# Altium project main_io.PrjPcb (part 3 of 6)

## Sheet can_uart.SchDoc: CAN and UART Interfaces
size A4; Organization: Badgerloop Electrical; Address1: 133 Engineering Research Building; Address2: 1500 Engineering Drive; Address3: Madison, Wi 53706
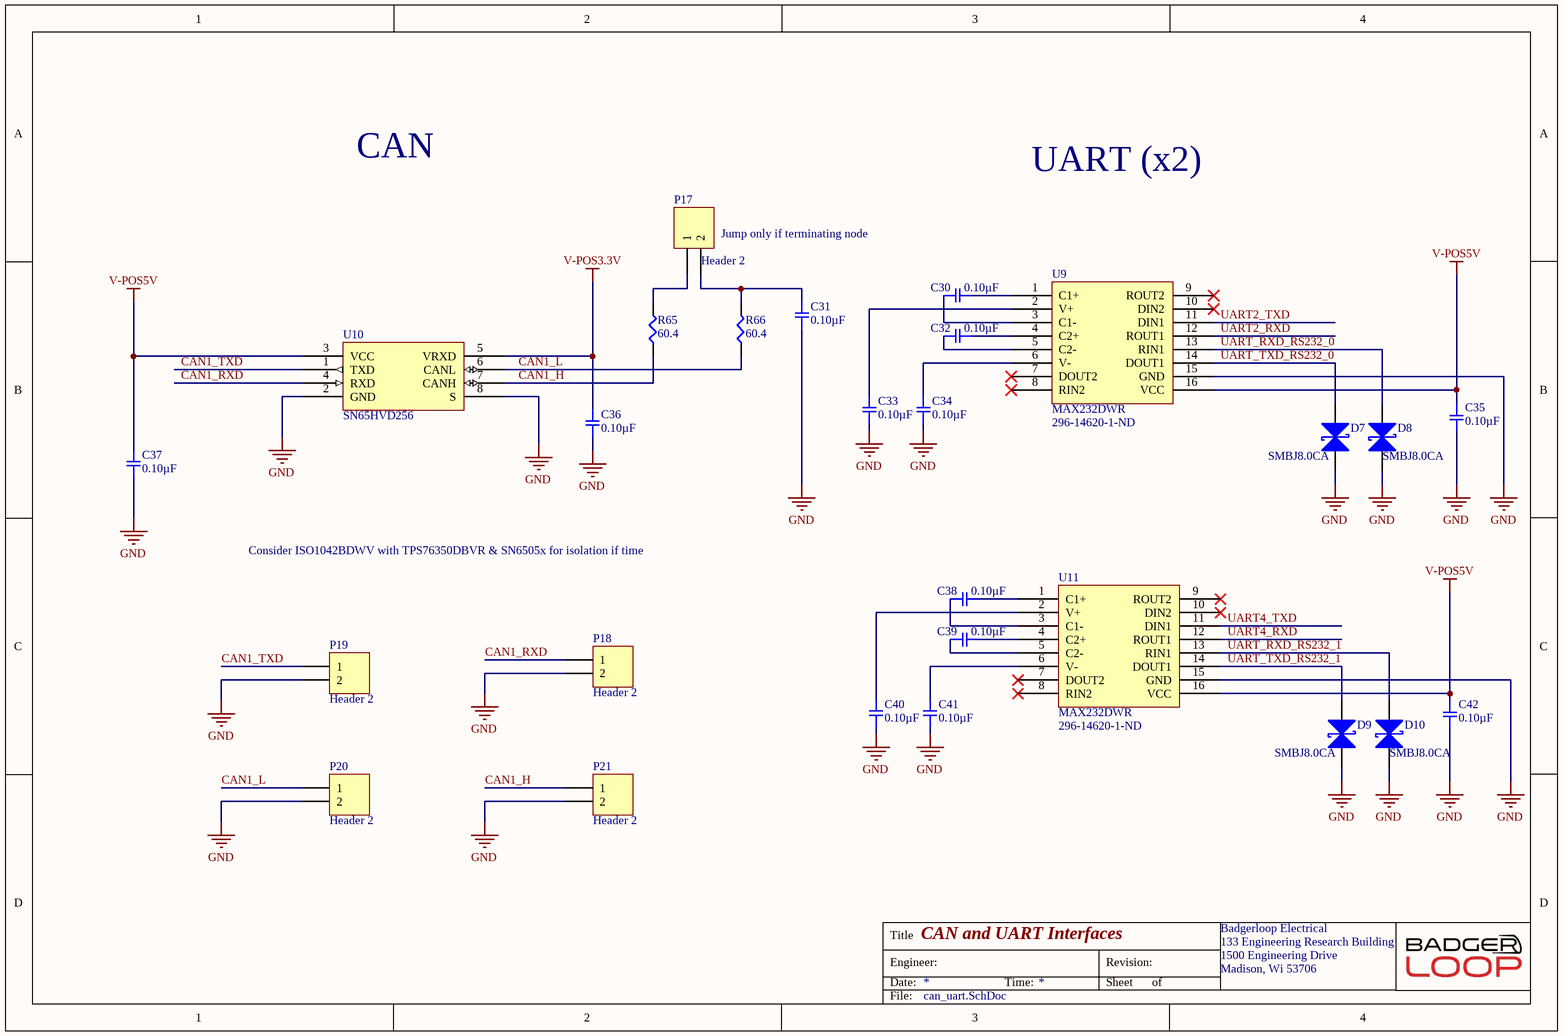
[diagram p6: can_uart.SchDoc]

### Parts
C30  0.10µF  [SMD-0805C]
C31  0.10µF  [SMD-0805C]
C32  0.10µF  [SMD-0805C]
C33  0.10µF  [SMD-0805C]
C34  0.10µF  [SMD-0805C]
C35  0.10µF  [SMD-0805C]
C36  0.10µF  [SMD-0805C]
C37  0.10µF  [SMD-0805C]
C38  0.10µF  [SMD-0805C]
C39  0.10µF  [SMD-0805C]
C40  0.10µF  [SMD-0805C]
C41  0.10µF  [SMD-0805C]
C42  0.10µF  [SMD-0805C]
D7  SMBJ8.0CA  [DIOM4436X26N]
D8  SMBJ8.0CA  [DIOM4436X26N]
D9  SMBJ8.0CA  [DIOM4436X26N]
D10  SMBJ8.0CA  [DIOM4436X26N]
P17  Header 2  [Pin Header 1x2 TH Pitch 2.54mm]
P18  Header 2  [Pin Header 1x2 TH Pitch 2.54mm]
P19  Header 2  [Pin Header 1x2 TH Pitch 2.54mm]
P20  Header 2  [Pin Header 1x2 TH Pitch 2.54mm]
P21  Header 2  [Pin Header 1x2 TH Pitch 2.54mm]
R65  60.4  [SMD-1206-RES]
R66  60.4  [SMD-1206-RES]
U9  MAX232DWR  Supplier Part Number 1: 296-14620-1-ND  [SOP127P1060X175-16N]
U10  SN65HVD256  [SOIC127P610X280-8N]
U11  MAX232DWR  Supplier Part Number 1: 296-14620-1-ND  [SOP127P1060X175-16N]

### Nets
GND: C31.1 C33.1 C34.1 C35.2 C36.1 C37.1 C40.1 C41.1 C42.2 D7.1(A) D8.1(A) D9.1(A) D10.1(A) P18.2 P19.2 P20.2 P21.2 U9.15(GND) U10.2(GND) U10.8(S) U11.15(GND)
V-POS3.3V: C36.2 U10.5(VRXD)
V-POS5V: C35.1 C37.2 C42.1 U9.16(VCC) U10.3(VCC) U11.16(VCC)
CAN1_H: P21.1 R65.1 U10.7(CANH)
CAN1_L: P20.1 R66.1 U10.6(CANL)
CAN1_RXD: P18.1 U10.4(RXD)
CAN1_TXD: P19.1 U10.1(TXD)
UART2_RXD: U9.12(ROUT1)
UART2_TXD: U9.11(DIN1)
UART4_RXD: U11.12(ROUT1)
UART4_TXD: U11.11(DIN1)
UART_RXD_RS232_0: D8.2(K) U9.13(RIN1)
UART_RXD_RS232_1: D10.2(K) U11.13(RIN1)
UART_TXD_RS232_0: D7.2(K) U9.14(DOUT1)
UART_TXD_RS232_1: D9.2(K) U11.14(DOUT1)
NetC30_1: C30.1 U9.3(C1-)
NetC30_2: C30.2 U9.1(C1+)
NetC31_2: C31.2 P17.2 R66.2
NetC32_1: C32.1 U9.5(C2-)
NetC32_2: C32.2 U9.4(C2+)
NetC33_2: C33.2 U9.2(V+)
NetC34_2: C34.2 U9.6(V-)
NetC38_1: C38.1 U11.3(C1-)
NetC38_2: C38.2 U11.1(C1+)
NetC39_1: C39.1 U11.5(C2-)
NetC39_2: C39.2 U11.4(C2+)
NetC40_2: C40.2 U11.2(V+)
NetC41_2: C41.2 U11.6(V-)
NetP17_1: P17.1 R65.2

Not connected (* = marked no-connect by the designer): U9 7(DOUT2)* 8(RIN2)* 9(ROUT2)* 10(DIN2)*; U11 7(DOUT2)* 8(RIN2)* 9(ROUT2)* 10(DIN2)*

### Notes on the sheet
- CAN
- UART (x2)
- (near P17) Jump only if terminating node
- Consider ISO1042BDWV with TPS76350DBVR & SN6505x for isolation if time
- Title
- Engineer:
- Date:
- Time:
- Revision:
- Sheet
- of
- File:

### Library data of the parts
C30-C34 C36-C41 = GRM219R71C104JA01D: CAP CER 0.1UF 16V X7R 0805; Manufacturer: Murata Electronics North America; Factory Stock: 0; Unit Price (USD): 0.12; Minimum Quantity: 1; Tolerance: ±5%; Datasheets: -; Image: //media.digikey.com/Renders/Murata%20Renders/0805%20(2012%20Metric)%20.85mm.jpg; Digi-Key Part Number: 490-12557-1-ND; Part Number: GRM219R71C104JA01D; Quantity Available: 6635; @ qty: 0; Packaging: Cut Tape (CT); Series: GRM; Part Status: Active; Value: 0.10µF; Voltage: 16V; Temperature Coefficient: X7R; Operating Temperature: -55°C ~ 125°C; Features: -; Ratings: -; Applications: General Purpose; Mounting Type: Surface Mount, MLCC; Package / Case: 0805 (2012 Metric); Size / Dimension: 0.079" L x 0.049" W (2.00mm x 1.25mm); Height - Seated (Max): -; Thickness (Max): 0.037" (0.95mm); Lead Spacing: -; Lead Style: -
C35 C42 = GRM219R71E104KA01D: CAP CER 0.1UF 25V X7R 0805; Manufacturer: Murata Electronics North America; Factory Stock: 0; Unit Price (USD): 0.12; Minimum Quantity: 1; Tolerance: ±10%; Datasheets: http://www.murata.com/~/media/webrenewal/support/library/catalog/products/capacitor/mlcc/c02e.pdf; Image: //media.digikey.com/Renders/Murata%20Renders/0805%20(2012%20Metric)%20.85mm.jpg; Digi-Key Part Number: 490-12754-1-ND; Part Number: GRM219R71E104KA01D; Quantity Available: 8594; @ qty: 0; Packaging: Cut Tape (CT); Series: GRM; Part Status: Active; Value: 0.10µF; Voltage: 25V; Temperature Coefficient: X7R; Operating Temperature: -55°C ~ 125°C; Features: -; Ratings: -; Applications: General Purpose; Mounting Type: Surface Mount, MLCC; Package / Case: 0805 (2012 Metric); Size / Dimension: 0.079" L x 0.049" W (2.00mm x 1.25mm); Height - Seated (Max): -; Thickness (Max): 0.037" (0.95mm); Lead Spacing: -; Lead Style: -
D7-D10 = SMBJ8.0CA: TVS DIODE 8V 13.6V DO214AA; Manufacturer: Littelfuse; Polarity: Bidirectional; Peak Pulse Power: 600W; Max Surge Current: 44.2A; Breakdown Voltage: 8.89V; Test Current: 1mA; Number of Channels: 1; Leakage Current: 100uA; Power Line Protection: No; Max Breakdown Voltage: 9.83V; Supplier 1: Digi-Key; Stock 1: 700; Pricing 1: 1=0.39, 10=0.313, 25=0.2864, 100=0.1798, 250=0.17784, 500=0.1665, 1000=0.11322 (USD); Mount: Surface Mount; Case/Package: SMB; Number of Pins: 2; Min Operating Temperature: -65°C; Max Operating Temperature: 150°C; Packaging: Tape and Reel; Clamping Voltage: 13.6V; Package Quantity: 3000; Reverse Standoff Voltage: 8V; Min Breakdown Voltage: 8.89V; Peak Pulse Current: 44.2A; Direction: Bidirectional; Reverse Breakdown Voltage: 8.89V; Operating Supply Voltage: 8V; Termination: SMD/SMT; Number of Elements: 1; Number of Bidirectional Channels: 1; Composition: Zener; Max Power Dissipation: 600W; Voltage Rating (DC): 8V; Power Dissipation: 600W; Length: 5.59mm; Height: 2.44mm; Width: 3.94mm; Lead Free: Lead Free; REACH SVHC: No SVHC; ComponentLink1URL: http://www.littelfuse.com/~/media/electronics/datasheets/tvs_diodes/littelfuse_tvs_diode_smbj_datasheet.pdf.pdf?src-supplier=Digi-Key; ComponentLink1Description: http://www.littelfuse.com/~/media/electronics/datasheets/tvs_diodes/littelfuse_tvs_diode_smbj_datasheet.pdf.pdf?src-supplier=Digi-Key; ComponentLink2URL: http://www.littelfuse.com/data/en/Data_Sheets/Littelfuse_TVS-Diode_SMBJ.pdf?src-supplier=Element14; ComponentLink2Description: http://www.littelfuse.com/data/en/Data_Sheets/Littelfuse_TVS-Diode_SMBJ.pdf?src-supplier=Element14; Supplier Part Number 1: SMBJ8.0CALFCT-ND
P17-P21 = Header 2: Header, 2-Pin; LatestRevisionDate: 17-Jul-2002; LatestRevisionNote: Re-released for DXP Platform.; Publisher: Altium Limited
R65 R66 = ERJ-8ENF60R4V: RES SMD 60.4 OHM 1% 1/4W 1206; Manufacturer: Panasonic Electronic Components; Factory Stock: 0; Unit Price (USD): 0.00933; @ qty: 1500; Minimum Quantity: 1; Power (Watts): 0.25W, 1/4W; Temperature Coefficient: ±100ppm/°C; Part Number: ERJ-8ENF60R4V; Datasheets: http://industrial.panasonic.com/www-cgi/jvcr13pz.cgi?E+PZ+3+AOA0002+ERJ8ENF60R4V+7+WW; Image: //media.digikey.com/Renders/Panasonic%20Renders/ERJ-1206%20Pkg.jpg; Digi-Key Part Number: P60.4FCT-ND; Quantity Available: 94102; Packaging: Cut Tape (CT); Series: ERJ; Part Status: Active; Value: 60.4; Tolerance: ±1%; Composition: Thick Film; Features: Automotive AEC-Q200; Operating Temperature: -55°C ~ 155°C; Package / Case: 1206 (3216 Metric); Supplier Device Package: 1206; Size / Dimension: 0.126" L x 0.063" W (3.20mm x 1.60mm); Height - Seated (Max): 0.028" (0.70mm); Number of Terminations: 2; Failure Rate: -
U9 U11 = MAX232DWR: IC DRVR/RCVR MULTCH RS232 16SOIC; Manufacturer: Texas Instruments; Nominal Supply Current: 10mA; Data Rate: 120Kbps; Number of Drivers: 2; Operating Supply Voltage: 5V; Min Supply Voltage: 4.5V; Max Supply Voltage: 5.5V; Logic Function: Transceiver,Receiver; Number of Transceivers: 1; Simplex/Duplex: Full Duplex; Supplier 1: Digi-Key; Manufacturer Part Number: MAX232DWR; Stock 1: 5901; Pricing 1: 1=1.16, 10=1.036, 100=0.7551, 500=0.63222, 1000=0.49172 (USD); Mount: Surface Mount; Case/Package: SOIC; Number of Pins: 16; Weight: 0.014829oz; Min Operating Temperature: -40°C; Max Operating Temperature: 85°C; Packaging: Tape and Reel; Package Quantity: 2000; Number of Receivers: 2; Number of Transmitters: 2; Length: 10.28mm; Height: 2.35mm; Width: 7.52mm; Radiation Hardening: No; Lead Free: Lead Free; REACH SVHC: No SVHC; ComponentLink1URL: http://www.ti.com/lit/ds/symlink/max232.pdf?src-supplier=Digi-Key; ComponentLink1Description: http://www.ti.com/lit/ds/symlink/max232.pdf?src-supplier=Digi-Key; ComponentLink2URL: http://datasheet.iiic.cc/texas_instruments/MAX232DWR.pdf?src-supplier=IIIC; ComponentLink2Description: http://datasheet.iiic.cc/texas_instruments/MAX232DWR.pdf?src-supplier=IIIC
U10 = SN65HVD256: IC TXRX CAN 5V HS 8SOIC; Manufacturer: TI; Manufacturer P/N: SN65HVD256DR; Digikey P/N: 296-30093-1-ND; Digikey Link: https://www.digikey.com/product-detail/en/texas-instruments/SN65HVD256DR/296-30093-1-ND/2798832

## Sheet retros.SchDoc: Retros
size A4; Organization: Badgerloop Electrical; Address1: 133 Engineering Research Building; Address2: 1500 Engineering Drive; Address3: Madison, Wi 53706
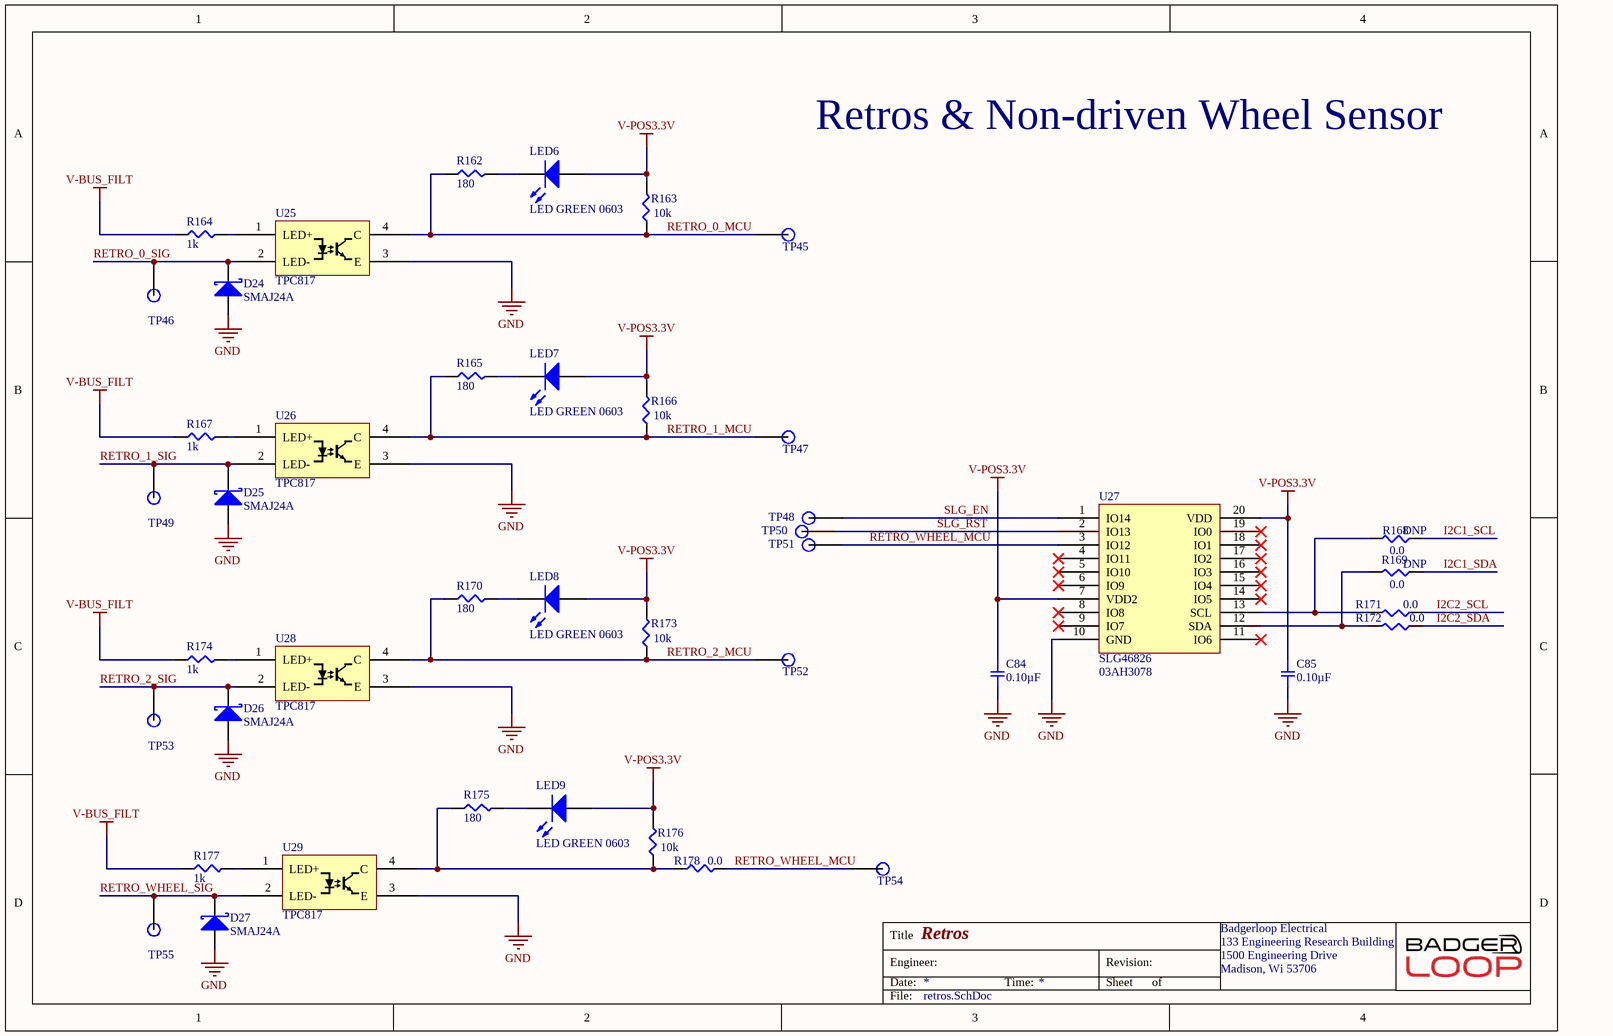
[diagram p7: retros.SchDoc]

### Parts
C84  0.10µF  [SMD-0805C]
C85  0.10µF  [SMD-0805C]
D24  SMAJ24A  [INDM5026X18N]
D25  SMAJ24A  [INDM5026X18N]
D26  SMAJ24A  [INDM5026X18N]
D27  SMAJ24A  [INDM5026X18N]
LED6  LED GREEN 0603  [LED 0603 GREEN]
LED7  LED GREEN 0603  [LED 0603 GREEN]
LED8  LED GREEN 0603  [LED 0603 GREEN]
LED9  LED GREEN 0603  [LED 0603 GREEN]
R162  180  [SMD-0805-RES]
R163  10k  [SMD-0805-RES]
R164  1k  [SMD-0805-RES]
R165  180  [SMD-0805-RES]
R166  10k  [SMD-0805-RES]
R167  1k  [SMD-0805-RES]
R168  0.0  [SMD-0805-RES]
R169  0.0  [SMD-0805-RES]
R170  180  [SMD-0805-RES]
R171  0.0  [SMD-0805-RES]
R172  0.0  [SMD-0805-RES]
R173  10k  [SMD-0805-RES]
R174  1k  [SMD-0805-RES]
R175  180  [SMD-0805-RES]
R176  10k  [SMD-0805-RES]
R177  1k  [SMD-0805-RES]
R178  0.0  [SMD-1206-RES]
TP45  TP  [Test Point]  (value not drawn)
TP46  TP  [Test Point]  (value not drawn)
TP47  TP  [Test Point]  (value not drawn)
TP48  TP  [Test Point]  (value not drawn)
TP49  TP  [Test Point]  (value not drawn)
TP50  TP  [Test Point]  (value not drawn)
TP51  TP  [Test Point]  (value not drawn)
TP52  TP  [Test Point]  (value not drawn)
TP53  TP  [Test Point]  (value not drawn)
TP54  TP  [Test Point]  (value not drawn)
TP55  TP  [Test Point]  (value not drawn)
U25  TPC817  [SOT200P1005X328-5N]
U26  TPC817  [SOT200P1005X328-5N]
U27  SLG46826  Supplier Part Number 1: 03AH3078  [SOP65P640X175-20N]
U28  TPC817  [SOT200P1005X328-5N]
U29  TPC817  [SOT200P1005X328-5N]

### Nets
GND: C84.2 C85.2 D24.2(K) D25.2(K) D26.2(K) D27.2(K) U25.3(E) U26.3(E) U27.10(GND) U28.3(E) U29.3(E)
V-BUS_FILT: R164.1 R167.1 R174.1 R177.1  [project net MSTR_SW +]
V-POS3.3V: C84.1 C85.1 LED6.1(A) LED7.1(A) LED8.1(A) LED9.1(A) R163.2 R166.2 R173.2 R176.2 U27.7(VDD2) U27.20(VDD)
I2C1_SCL: R168.1
I2C1_SDA: R169.1
I2C2_SCL: R171.1
I2C2_SDA: R172.1
RETRO_0_MCU: R162.1 R163.1 TP45.1 U25.4(C)
RETRO_0_SIG: D24.1(A) TP46.1 U25.2(LED-)
RETRO_1_MCU: R165.1 R166.1 TP47.1 U26.4(C)
RETRO_1_SIG: D25.1(A) TP49.1 U26.2(LED-)
RETRO_2_MCU: R170.1 R173.1 TP52.1 U28.4(C)
RETRO_2_SIG: D26.1(A) TP53.1 U28.2(LED-)
RETRO_WHEEL_MCU: R178.2 TP51.1 TP54.1 U27.3(IO12)
RETRO_WHEEL_SIG: D27.1(A) TP55.1 U29.2(LED-)
SLG_EN: TP48.1 U27.1(IO14)
SLG_RST: TP50.1 U27.2(IO13)
NetLED6_2: LED6.2(K) R162.2
NetLED7_2: LED7.2(K) R165.2
NetLED8_2: LED8.2(K) R170.2
NetLED9_2: LED9.2(K) R175.2
NetR164_2: R164.2 U25.1(LED+)
NetR167_2: R167.2 U26.1(LED+)
NetR168_2: R168.2 R171.2 U27.13(SCL)
NetR169_2: R169.2 R172.2 U27.12(SDA)
NetR174_2: R174.2 U28.1(LED+)
NetR175_1: R175.1 R176.1 R178.1 U29.4(C)
NetR177_2: R177.2 U29.1(LED+)

Not connected (* = marked no-connect by the designer): U27 4(IO11)* 5(IO10)* 6(IO9)* 8(IO8)* 9(IO7)* 11(IO6)* 14(IO5)* 15(IO4)* 16(IO3)* 17(IO2)* 18(IO1)* 19(IO0)*

### Notes on the sheet
- Retros & Non-driven Wheel Sensor
- Title
- Engineer:
- Date:
- Time:
- Revision:
- Sheet
- of
- File:

### Library data of the parts
C84 C85 = GRM219R71E104KA01D: as C35 on sheet can_uart; Datasheets: http://www.murata.com/~/media/webrenewal/support/library/catalog/products/capacitor/mlcc/c02e.pdf; Image: //media.digikey.com/Renders/Murata%20Renders/0805%20(2012%20Metric)%20.85mm.jpg; Digi-Key Part Number: 490-12754-1-ND; Part Number: GRM219R71E104KA01D; Quantity Available: 8594; @ qty: 0; Packaging: Cut Tape (CT); Series: GRM; Part Status: Active; Value: 0.10µF; Voltage: 25V; Temperature Coefficient: X7R; Operating Temperature: -55°C ~ 125°C; Features: -; Ratings: -; Applications: General Purpose; Mounting Type: Surface Mount, MLCC; Package / Case: 0805 (2012 Metric); Size / Dimension: 0.079" L x 0.049" W (2.00mm x 1.25mm); Height - Seated (Max): -; Thickness (Max): 0.037" (0.95mm); Lead Spacing: -; Lead Style: -
D24-D27 = SMAJ24A: TVS DIODE 24V 38.9V DO214AC; Manufacturer: LittelFuse Inc; Digikey P/N: SMAJ24ALFCT-ND; Digikey Link: https://www.digikey.com/product-detail/en/littelfuse-inc/SMAJ24A/SMAJ24ALFCT-ND/762500; Manufacturer P/N: SMAJ24A
LED6-LED9 = LED GREEN 0603: Manufacturer: Lite-On Inc.; Manufacturer P/N: LTST-C190KGKT; Digikey P/N: 160-1435-1-ND; Package / Case: 0603; Color: GREEN
R162 R165 R170 R175 = ERJ-6ENF1800V: RES SMD 180 OHM 1% 1/8W 0805; Manufacturer: Panasonic Electronic Components; Factory Stock: 0; Unit Price (USD): 0.00729; @ qty: 1500; Minimum Quantity: 1; Power (Watts): 0.125W, 1/8W; Temperature Coefficient: ±100ppm/°C; Part Number: ERJ-6ENF1800V; Datasheets: http://industrial.panasonic.com/www-cgi/jvcr13pz.cgi?E+PZ+3+AOA0002+ERJ6ENF1800V+7+WW; Image: //media.digikey.com/Renders/Panasonic%20Renders/ERJ-0805%20Pkg.jpg; Digi-Key Part Number: P180CCT-ND; Quantity Available: 33231; Packaging: Cut Tape (CT); Series: ERJ; Part Status: Active; Value: 180; Tolerance: ±1%; Composition: Thick Film; Features: Automotive AEC-Q200; Operating Temperature: -55°C ~ 155°C; Package / Case: 0805 (2012 Metric); Supplier Device Package: 0805; Size / Dimension: 0.079" L x 0.049" W (2.00mm x 1.25mm); Height - Seated (Max): 0.028" (0.70mm); Number of Terminations: 2; Failure Rate: -
R163 R166 R173 R176 = ERJ-6GEYJ103V: RES SMD 10K OHM 5% 1/8W 0805; Manufacturer: Panasonic Electronic Components; Factory Stock: 0; Unit Price (USD): 0.00496; @ qty: 1500; Minimum Quantity: 1; Power (Watts): 0.125W, 1/8W; Temperature Coefficient: ±200ppm/°C; Part Number: ERJ-6GEYJ103V; Datasheets: http://industrial.panasonic.com/www-cgi/jvcr13pz.cgi?E+PZ+3+AOA0001+ERJ6GEYJ103V+7+WW; Image: //media.digikey.com/Renders/Panasonic%20Renders/ERJ-0805%20Pkg.jpg; Digi-Key Part Number: P10KACT-ND; Quantity Available: 2328224; Packaging: Cut Tape (CT); Series: ERJ; Part Status: Active; Value: 10k; Tolerance: ±5%; Composition: Thick Film; Features: Automotive AEC-Q200; Operating Temperature: -55°C ~ 155°C; Package / Case: 0805 (2012 Metric); Supplier Device Package: 0805; Size / Dimension: 0.079" L x 0.049" W (2.00mm x 1.25mm); Height - Seated (Max): 0.028" (0.70mm); Number of Terminations: 2; Failure Rate: -
R164 R167 R174 R177 = ERJ-6ENF1001V: RES SMD 1K OHM 1% 1/8W 0805; Manufacturer: Panasonic Electronic Components; Factory Stock: 0; Unit Price (USD): 0.00729; @ qty: 1500; Minimum Quantity: 1; Power (Watts): 0.125W, 1/8W; Temperature Coefficient: ±100ppm/°C; Part Number: ERJ-6ENF1001V; Datasheets: http://industrial.panasonic.com/www-cgi/jvcr13pz.cgi?E+PZ+3+AOA0002+ERJ6ENF1001V+7+WW; Image: //media.digikey.com/Renders/Panasonic%20Renders/ERJ-0805%20Pkg.jpg; Digi-Key Part Number: P1.00KCCT-ND; Quantity Available: 12895103; Packaging: Cut Tape (CT); Series: ERJ; Part Status: Active; Value: 1k; Tolerance: ±1%; Composition: Thick Film; Features: Automotive AEC-Q200; Operating Temperature: -55°C ~ 155°C; Package / Case: 0805 (2012 Metric); Supplier Device Package: 0805; Size / Dimension: 0.079" L x 0.049" W (2.00mm x 1.25mm); Height - Seated (Max): 0.028" (0.70mm); Number of Terminations: 2; Failure Rate: -
R168 R169 R171 R172 = ERJ-6GEY0R00V: RES SMD 0.0 OHM JUMPER 1/8W 0805; Manufacturer: Panasonic Electronic Components; Factory Stock: 0; Unit Price (USD): 0.00544; @ qty: 1500; Minimum Quantity: 1; Power (Watts): 0.125W, 1/8W; Part Number: ERJ-6GEY0R00V; Datasheets: http://industrial.panasonic.com/www-cgi/jvcr13pz.cgi?E+PZ+3+AOA0001+ERJ6GEY0R00V+7+WW; Image: //media.digikey.com/Renders/Panasonic%20Renders/ERJ-0805%20Pkg.jpg; Digi-Key Part Number: P0.0ACT-ND; Quantity Available: 1597627; Packaging: Cut Tape (CT); Series: ERJ; Part Status: Active; Value: 0.0; Tolerance: Jumper; Composition: Thick Film; Features: Automotive AEC-Q200; Temperature Coefficient: -; Operating Temperature: -55°C ~ 155°C; Package / Case: 0805 (2012 Metric); Supplier Device Package: 0805; Size / Dimension: 0.079" L x 0.049" W (2.00mm x 1.25mm); Height - Seated (Max): 0.028" (0.70mm); Number of Terminations: 2; Failure Rate: -
  R168 R169: DNP: DNP
R178 = ERJ-8GEY0R00V: RES SMD 0.0 OHM JUMPER 1/4W 1206; Manufacturer: Panasonic Electronic Components; Factory Stock: 0; Unit Price (USD): 0.00768; @ qty: 1500; Minimum Quantity: 1; Power (Watts): 0.25W, 1/4W; Part Number: ERJ-8GEY0R00V; Datasheets: http://industrial.panasonic.com/www-cgi/jvcr13pz.cgi?E+PZ+3+AOA0001+ERJ8GEY0R00V+7+WW; Image: //media.digikey.com/Renders/Panasonic%20Renders/ERJ-1206%20Pkg.jpg; Digi-Key Part Number: P0.0ECT-ND; Quantity Available: 1074190; Packaging: Cut Tape (CT); Series: ERJ; Part Status: Active; Value: 0.0; Tolerance: Jumper; Composition: Thick Film; Features: Automotive AEC-Q200; Temperature Coefficient: -; Operating Temperature: -55°C ~ 155°C; Package / Case: 1206 (3216 Metric); Supplier Device Package: 1206; Size / Dimension: 0.126" L x 0.063" W (3.20mm x 1.60mm); Height - Seated (Max): 0.028" (0.70mm); Number of Terminations: 2; Failure Rate: -
TP45-TP55 = TP: SMD TEST POINT
U25 U26 U28 U29 = TPC817: OPTOISO 5KV TRANS 4SOP; Manufacturer: Taiwan Semi; Manufacturer P/N: TPC817S1B RAG; Digikey Link: https://www.digikey.com/product-detail/en/taiwan-semiconductor-corporation/TPC817S1B-RAG/TPC817S1BRAGCT-ND/7359679; Digikey P/N: TPC817S1BRAGCT-ND
U27 = SLG46826: GreenPAK Programmable Mixed Signal Matrix with In-System Programmability; Manufacturer: Dialog Semiconductor; Manufacturer Part Number: SLG46826V-SKT; Supplier 1: Newark; Stock 1: 4; Pricing 1: 1=45.65000, 5=44.43000, 10=43.15000, 25=42.51000, 50=41.89000, 100=39.38000 (USD); RoHS: No

## Sheet arduino_shield.SchDoc: Arduino Shield
size A4; Organization: Badgerloop Electrical; Address1: 133 Engineering Research Building; Address2: 1500 Engineering Drive; Address3: Madison, Wi 53706
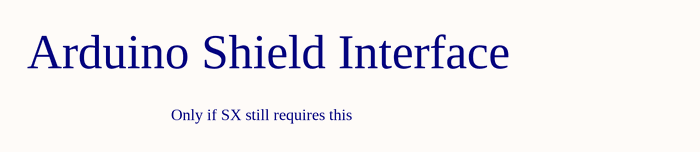
[diagram p8: arduino_shield.SchDoc]

### Notes on the sheet
- Arduino Shield Interface
- Only if SX still requires this
- Title
- Engineer:
- Date:
- Time:
- Revision:
- Sheet
- of
- File:

## Sheet bms_interface.SchDoc: BMS Interface
size A4; Engineer: Shelby Riggleman; Organization: Badgerloop Electrical; Address1: 133 Engineering Research Building; Address2: 1500 Engineering Drive; Address3: Madison, Wi 53706; Revision: A
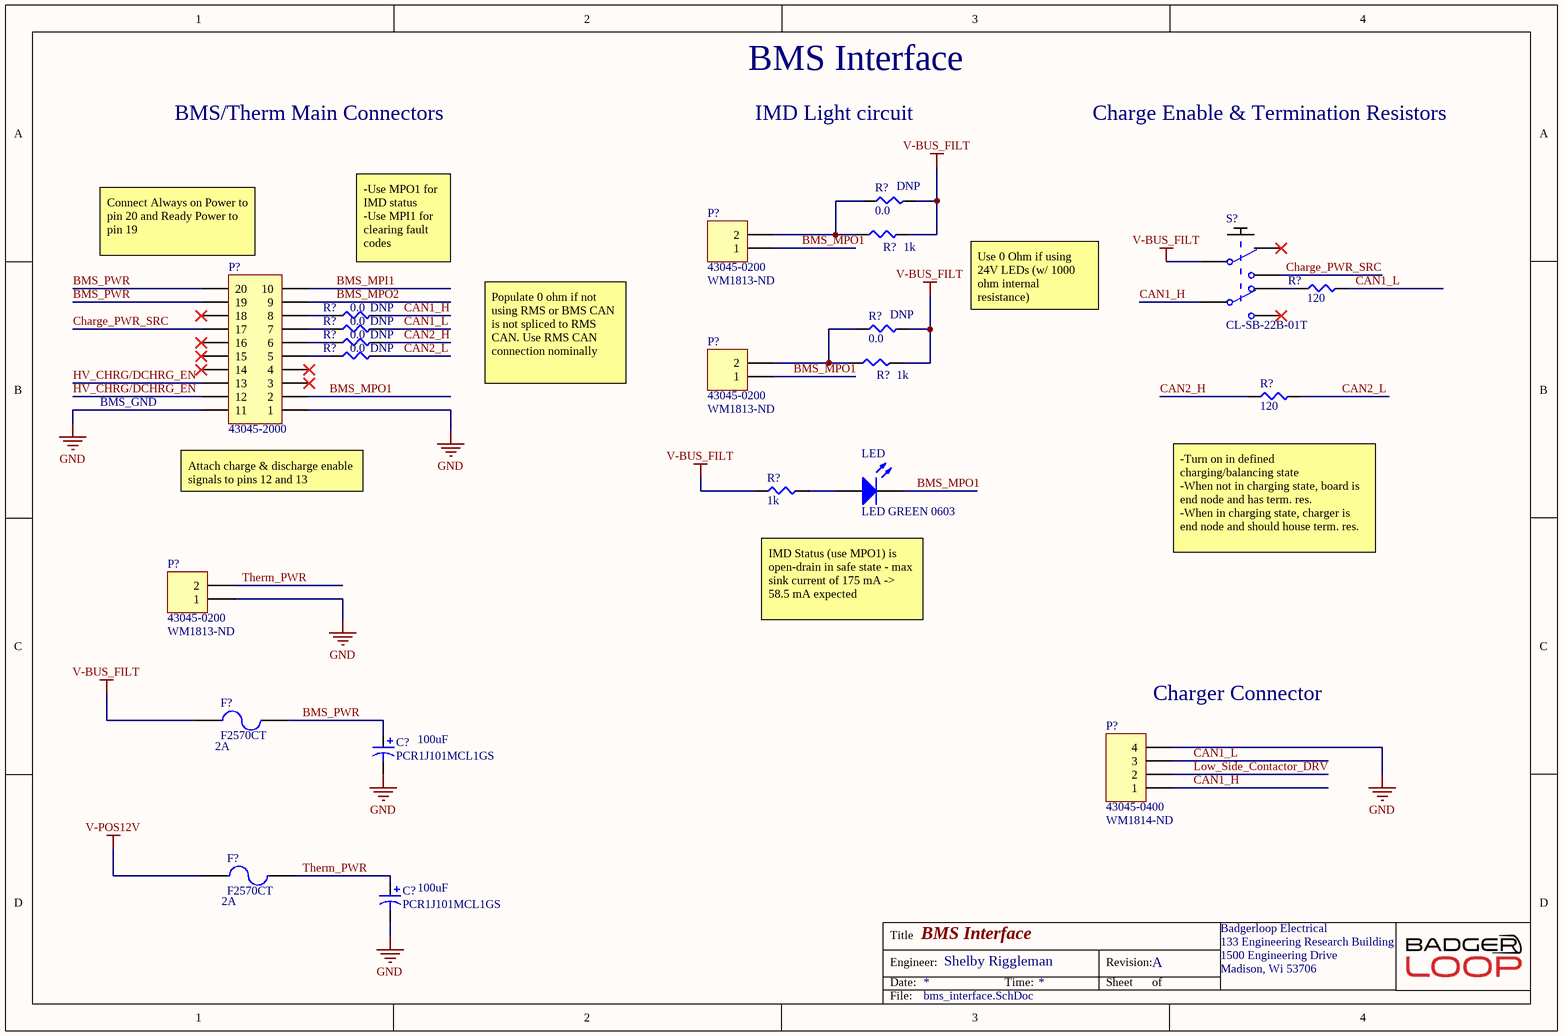
[diagram p9: bms_interface.SchDoc]

### Parts
(Parts that share a designator on the sheet are numbered #1, #2 ... from top to bottom, then left to right.)
C?#1  PCR1J101MCL1GS  Capacitance: 100uF  [CAPAE110103X126M]
C?#2  PCR1J101MCL1GS  Capacitance: 100uF  [CAPAE110103X126M]
F?#1  F2570CT  Current Rating: 2A  [SMD-1206-RES]
F?#2  F2570CT  Current Rating: 2A  [SMD-1206-RES]
LED  LED GREEN 0603  [LED 0603 GREEN]
P?#1  43045-0200  Supplier Part Number 1: WM1813-ND  [430450200]
P?#2  43045-0200  Supplier Part Number 1: WM1813-ND  [430450200]
P?#3  43045-2000  [430452000]
P?#4  43045-0200  Supplier Part Number 1: WM1813-ND  [430450200]
P?#5  43045-0400  Supplier Part Number 1: WM1814-ND  [430450400]
R?#1  0.0  [SMD-1206-RES]
R?#2  1k  [SMD-0805-RES]
R?#3  120  [SMD-0805-RES]
R?#4  0.0  [SMD-1206-RES]
R?#5  0.0  [SMD-1206-RES]
R?#6  0.0  [SMD-1206-RES]
R?#7  0.0  [SMD-1206-RES]
R?#8  0.0  [SMD-1206-RES]
R?#9  1k  [SMD-0805-RES]
R?#10  120  [SMD-0805-RES]
R?#11  1k  [SMD-0805-RES]
S?  CL-SB-22B-01T  [SOP250P500X350-6N]

### Nets
GND: C?#1.2 C?#2.2 P?#3.1 P?#3.11 P?#4.1 P?#5.4
V-BUS_FILT: F?#1.1 R?#1.2 R?#2.2 R?#6.2 R?#9.2 R?#11.1 S?.2  [project net MSTR_SW +]
V-POS12V: F?#2.1
BMS_MPI1: P?#3.10
BMS_MPO1: LED.2(K) P?#1.1 P?#2.1 P?#3.2
BMS_MPO2: P?#3.9
BMS_PWR: C?#1.1 F?#1.2 P?#3.19 P?#3.20
CAN1_H: P?#5.1 R?#4.2 S?.5
CAN1_L: P?#5.3 R?#3.2 R?#5.2
CAN2_H: R?#7.2 R?#10.1
CAN2_L: R?#8.2 R?#10.2
Charge_PWR_SRC: P?#3.17 S?.3
HV_CHRG/DCHRG_EN: P?#3.12 P?#3.13
Low_Side_Contactor_DRV: P?#5.2
Therm_PWR: C?#2.1 F?#2.2 P?#4.2
NetLED_1: LED.1(A) R?#11.2
NetP?#1_2: P?#1.2 R?#1.1 R?#2.1
NetP?#2_2: P?#2.2 R?#6.1 R?#9.1
NetP?#3_5: P?#3.5 R?#8.1
NetP?#3_6: P?#3.6 R?#7.1
NetP?#3_7: P?#3.7 R?#5.1
NetP?#3_8: P?#3.8 R?#4.1
NetR?#3_1: R?#3.1 S?.4

Not connected (* = marked no-connect by the designer): P?#3 3* 4* 14* 15* 16* 18*; S? 1* 6*

### Notes on the sheet
- BMS Interface
- BMS/Therm Main Connectors
- IMD Light circuit
- Charge Enable & Termination Resistors
- (near P?#3) Connect Always on Power to pin 20 and Ready Power to pin 19
- -Use MPO1 for IMD status
  -Use MPI1 for clearing fault codes
- Use 0 Ohm if using 24V LEDs (w/ 1000 ohm internal resistance)
- Populate 0 ohm if not using RMS or BMS CAN is not spliced to RMS CAN. Use RMS CAN connection nominally
- BMS_GND
- (near P?#3) Attach charge & discharge enable signals to pins 12 and 13
- (near R?#10) -Turn on in defined charging/balancing state
  -When not in charging state, board is end node and has term. res.
  -When in charging state, charger is end node and should house term. res.
- IMD Status (use MPO1) is open-drain in safe state - max sink current of 175 mA -> 58.5 mA expected
- (near P?#5) Charger Connector
- Title
- Engineer:
- Date:
- Time:
- Revision:
- Sheet
- of
- File:

### Library data of the parts
C?#1 C?#2 = PCR1J101MCL1GS: CAP ALUM POLY 100UF 20% 63V SMD; Manufacturer: Nichicon; ESR (Equivalent Series Resistance): 24mR; Ripple Current: 3A; Leakage Current: 3uA; Life (Hours): 4000Hour; Dissipation Factor: 0.08%; Supplier 1: Digi-Key; Manufacturer Part Number: PCR1J101MCL1GS; Stock 1: 11476; Pricing 1: 1=3.63000, 10=2.92800, 100=2.28380 (USD); RoHS: Yes; Mount: Surface Mount,PCB; Case/Package: Radial; Weight: 0.045856oz; Min Operating Temperature: -55°C; Max Operating Temperature: 125°C; Tolerance: 20%; Voltage Rating (DC): 63V; Package Quantity: 1; Packaging: Tape and Reel; Voltage Rating: 63V; Termination: SMD/SMT; Voltage: 63V; Diameter: 10mm; Length: 12.7mm; Height: 12.7mm; Height - Seated (Max): 0.504inch; Depth: 10.3mm; Lead Pitch: 4.6mm; Lead Free: Lead Free; ComponentLink1URL: https://datasheet.ciiva.com/29551/e-ch-ta-29551389.pdf?src-supplier=Digi-Key; ComponentLink1Description: https://datasheet.ciiva.com/29551/e-ch-ta-29551389.pdf?src-supplier=Digi-Key; ComponentLink2URL: https://datasheet.ciiva.com/29551/e-ch-ta-29551390.pdf?src-supplier=Digi-Key; ComponentLink2Description: https://datasheet.ciiva.com/29551/e-ch-ta-29551390.pdf?src-supplier=Digi-Key; ComponentLink3URL: https://datasheet.ciiva.com/29551/e-ch-ta-29551391.pdf?src-supplier=Digi-Key; ComponentLink3Description: https://datasheet.ciiva.com/29551/e-ch-ta-29551391.pdf?src-supplier=Digi-Key; Supplier Part Number 1: 493-13783-1-ND
F?#1 F?#2 = F2570CT: FUSE BOARD MNT 2A 63VAC/VDC 1206; Manufacturer: Littelfuse; Manufacturer Part Number: 0468002.NR; Voltage Rating (AC): 63V; Resistance: 32.4mR; Power Dissipation: 154.5mW; Fuse Type: Board Mount (Cartridge Style Excluded); Approvals: UL,CSA; Supplier 1: Digi-Key; Stock 1: 13091; Pricing 1: 1=1.2, 5=1.166, 10=1.091, 50=0.9028, 100=0.7524, 250=0.7336, 500=0.62074, 1000=0.54549 (USD); Mount: Surface Mount; Case/Package: 1206; Number of Pins: 2; Case Code (Metric): 3216; Case Code (Imperial): 1206; Terminal Material: Tin; Min Operating Temperature: -55°C; Max Operating Temperature: 90°C; Voltage Rating (DC): 63V; Packaging: Tape and Reel; Package Quantity: 5000; Voltage Rating: 63V; Termination: SMD/SMT; Composition: Thin Film; DC Cold Resistance: 32.4mR; Fuse Current: 2A; Length: 3.18mm; Height: 0.58mm; Width: 1.52mm; Depth: 1.52mm; Radiation Hardening: No; REACH SVHC: Unknown; Lead Free: Lead Free; ComponentLink1URL: http://www.farnell.com/datasheets/94905.pdf?src-supplier=Farnell; ComponentLink1Description: http://www.farnell.com/datasheets/94905.pdf?src-supplier=Farnell; ComponentLink2URL: http://www.littelfuse.com/~/media/electronics/datasheets/fuses/littelfuse_fuse_468_datasheet.pdf.pdf?src-supplier=Digi-Key; ComponentLink2Description: http://www.littelfuse.com/~/media/electronics/datasheets/fuses/littelfuse_fuse_468_datasheet.pdf.pdf?src-supplier=Digi-Key; ComponentLink3URL: http://www.farnell.com/datasheets/1851811.pdf?src-supplier=Element14; ComponentLink3Description: http://www.farnell.com/datasheets/1851811.pdf?src-supplier=Element14; ComponentLink4URL: http://www.littelfuse.com/~/media/electronics/datasheets/fuses/littelfuse_fuse_468_datasheet.pdf.pdf?src-supplier=Future+Electronics; ComponentLink4Description: http://www.littelfuse.com/~/media/electronics/datasheets/fuses/littelfuse_fuse_468_datasheet.pdf.pdf?src-supplier=Future+Electronics; Supplier Part Number 1: F2570DKR-ND
LED = LED GREEN 0603: as LED6 on sheet retros; Digikey P/N: 160-1435-1-ND; Package / Case: 0603; Color: GREEN
P?#1 P?#2 P?#4 = 43045-0200: CONN HEADER R/A 2POS; Manufacturer: Molex; Contact Resistance: 10mR; Number of Contacts: 2; Voltage Rating: 600V; Current Rating: 5A; Gender: Male; Max Voltage Rating (DC): 250.25kV; Voltage Rating (DC): 250V; Insulation Resistance: 1GR; Pitch: 3mm; Glow Wire Compliant: Compliant; Approvals: UL,CSA,TUV; Supplier 1: Digi-Key; Manufacturer Part Number: 43045-0200; Stock 1: 6320; Pricing 1: 1=0.97000, 10=0.84900, 100=0.73280, 500=0.59958, 1000=0.53296, 5000=0.46634, 10000=0.44302 (USD); RoHS: Yes; Mount: Through Hole; Case/Package: SMC; Contact Plating: Tin; Color: Black; Contact Material: Brass,Tin; Housing Color: Black; Housing Material: Thermoplastic; Material: Thermoplastic; Min Operating Temperature: -40°C; Max Operating Temperature: 105°C; Termination: Through Hole; Number of Rows: 2; Orientation: Right Angle; Packaging: Tray; Number of Positions: 2; Package Quantity: 3168; Number of Circuits: 2; Contact Gender: Male; Diameter: 3mm; Row Spacing: 3mm; Radiation Hardening: No; Flammability Rating: UL94 V-0; REACH SVHC: Unknown; Lead Free: Lead Free; Halogen Free: Low Halogen; ComponentLink1URL: https://datasheet.ciiva.com/14155/04402310-14155203.pdf?src-supplier=Distrelec; ComponentLink1Description: https://datasheet.ciiva.com/14155/04402310-14155203.pdf?src-supplier=Distrelec; ComponentLink2URL: https://datasheet.ciiva.com/19454/883270-19454006.pdf?src-supplier=Jameco; ComponentLink2Description: https://datasheet.ciiva.com/19454/883270-19454006.pdf?src-supplier=Jameco; ComponentLink3URL: https://datasheet.ciiva.com/5150/0430450200-pcb-headers-145770-5150407.pdf?src-supplier=Mouser; ComponentLink3Description: https://datasheet.ciiva.com/5150/0430450200-pcb-headers-145770-5150407.pdf?src-supplier=Mouser; ComponentLink4URL: https://datasheet.ciiva.com/11747/0900766b80027348-11747001.pdf?src-supplier=RSComponents; ComponentLink4Description: https://datasheet.ciiva.com/11747/0900766b80027348-11747001.pdf?src-supplier=RSComponents; ComponentLink5URL: https://datasheet.ciiva.com/16656/0430450200-pcb-headers-16656330.pdf?src-supplier=Avnet+Europe; ComponentLink5Description: https://datasheet.ciiva.com/16656/0430450200-pcb-headers-16656330.pdf?src-supplier=Avnet+Europe; ComponentLink6URL: https://datasheet.ciiva.com/10090/0430450200-pcb-headers-10090299.pdf?src-supplier=Avnet; ComponentLink6Description: https://datasheet.ciiva.com/10090/0430450200-pcb-headers-10090299.pdf?src-supplier=Avnet; ComponentLink7URL: https://datasheet.ciiva.com/36854/124280430450200-pcb-headers-36854331.pdf?src-supplier=Onlinecomponents.com; ComponentLink7Description: https://datasheet.ciiva.com/36854/124280430450200-pcb-headers-36854331.pdf?src-supplier=Onlinecomponents.com; ComponentLink8URL: https://datasheet.ciiva.com/1443/1859921-1443437.pdf?src-supplier=Element14; ComponentLink8Description: https://datasheet.ciiva.com/1443/1859921-1443437.pdf?src-supplier=Element14
P?#3 = 43045-2000: HEADER, RIGHT ANGLE, 20WAY; Manufacturer: Molex; Number of Positions: 20; Contact Resistance: 10mR; Current Rating: 5A; Voltage Rating: 600V; Voltage Rating (AC): 250V; Max Voltage Rating (DC): 250.25kV; Gender: Male; Insulation Resistance: 1GR; Pitch: 3mm; Approvals: UL,CSA,TUV; Glow Wire Compliant: Compliant; Supplier 1: Digi-Key; Manufacturer Part Number: 43045-2000; Stock 1: 1197; Pricing 1: 1=5.17000, 10=4.95900, 100=4.13220, 500=3.51238, 1000=2.99585 (USD); RoHS: Yes; Mount: Through Hole; Contact Plating: Tin; Color: Black; Contact Material: Brass,Tin; Housing Color: Black; Housing Material: Thermoplastic; Material: Polyester; Min Operating Temperature: -40°C; Max Operating Temperature: 105°C; Number of Rows: 2; Termination: Solder; Packaging: Tray; Number of Contacts: 20; Package Quantity: 648; Orientation: Right Angle; Number of Poles: 20; Max Current Rating: 5A; Number of Circuits: 20; Working Voltage: 250V; Voltage Rating (DC): 250V; Operating Supply Voltage: 250V; Length: 34.15mm; Height: 8.77mm; Row Spacing: 3mm; Depth: 12.2mm; Lead Pitch: 3mm; Radiation Hardening: No; Flammability Rating: UL94 V-0; Halogen Free: Low Halogen; Lead Free: Lead Free; ComponentLink1URL: https://datasheet.ciiva.com/5158/0430452000-pcb-headers-143029-5158912.pdf?src-supplier=Mouser; ComponentLink1Description: https://datasheet.ciiva.com/5158/0430452000-pcb-headers-143029-5158912.pdf?src-supplier=Mouser; ComponentLink2URL: https://datasheet.ciiva.com/30232/144790430452000-pcb-headers-30232337.pdf?src-supplier=Onlinecomponents.com; ComponentLink2Description: https://datasheet.ciiva.com/30232/144790430452000-pcb-headers-30232337.pdf?src-supplier=Onlinecomponents.com; ComponentLink3URL: https://datasheet.ciiva.com/11747/0900766b80d6135b-11747452.pdf?src-supplier=RSComponents; ComponentLink3Description: https://datasheet.ciiva.com/11747/0900766b80d6135b-11747452.pdf?src-supplier=RSComponents; ComponentLink4URL: https://datasheet.ciiva.com/19461/800067-19461036.pdf?src-supplier=Jameco; ComponentLink4Description: https://datasheet.ciiva.com/19461/800067-19461036.pdf?src-supplier=Jameco; ComponentLink5URL: https://datasheet.ciiva.com/1443/1786399-1443623.pdf?src-supplier=Element14; ComponentLink5Description: https://datasheet.ciiva.com/1443/1786399-1443623.pdf?src-supplier=Element14; ComponentLink6URL: https://datasheet.ciiva.com/10076/0430452000-pcb-headers-10076859.pdf?src-supplier=Avnet; ComponentLink6Description: https://datasheet.ciiva.com/10076/0430452000-pcb-headers-10076859.pdf?src-supplier=Avnet; ComponentLink7URL: https://datasheet.ciiva.com/14155/04402310-14155212.pdf?src-supplier=Distrelec; ComponentLink7Description: https://datasheet.ciiva.com/14155/04402310-14155212.pdf?src-supplier=Distrelec; Supplier Part Number 1: WM4726-ND
P?#5 = 43045-0400: Male connector dual row 90° 3 mm Pole no. 2x2 Micro-Fit, 43045-0400, Molex; Contact Resistance: 10mR; Number of Contacts: 4; Max Voltage Rating (AC): 250V; Connector Type: Male Pin; Pitch: 3mm; Row Spacing: 0.118inch; Supplier 1: Digi-Key; Manufacturer: Molex; Manufacturer Part Number: 43045-0400; Stock 1: 5904; Pricing 1: 1=1.33000, 10=1.16700, 100=1.00670, 500=0.82368, 1000=0.73216, 5000=0.64064, 10000=0.60861 (USD); RoHS: Yes; Mount: Through Hole; Contact Plating: Tin; Color: Black; Contact Material: Brass; Housing Color: Black; Housing Material: Polymer; Min Operating Temperature: -40°C; Max Operating Temperature: 105°C; Number of Rows: 2; Termination: Solder; Packaging: Tray; Fastening Type: Ramp; Number of Positions: 4; Orientation: Right Angle; Length: 10.15mm; Depth: 12.2mm; Flammability Rating: UL94 V-0; ComponentLink1URL: https://datasheet.ciiva.com/712/430450200-sd-712017.pdf?src-supplier=Digi-Key; ComponentLink1Description: https://datasheet.ciiva.com/712/430450200-sd-712017.pdf?src-supplier=Digi-Key; ComponentLink2URL: https://datasheet.ciiva.com/20209/22-3744e-20209522.pdf?src-supplier=Rapid+Electronics; ComponentLink2Description: https://datasheet.ciiva.com/20209/22-3744e-20209522.pdf?src-supplier=Rapid+Electronics; ComponentLink3URL: https://datasheet.ciiva.com/11746/0900766b80027348-11746988.pdf?src-supplier=RSComponents; ComponentLink3Description: https://datasheet.ciiva.com/11746/0900766b80027348-11746988.pdf?src-supplier=RSComponents; ComponentLink4URL: https://datasheet.ciiva.com/30193/145420430450400-pcb-headers-30193310.pdf?src-supplier=Onlinecomponents.com; ComponentLink4Description: https://datasheet.ciiva.com/30193/145420430450400-pcb-headers-30193310.pdf?src-supplier=Onlinecomponents.com
R?#1 R?#4-R?#8 = ERJ-8GEY0R00V: as R178 on sheet retros; Part Number: ERJ-8GEY0R00V; Datasheets: http://industrial.panasonic.com/www-cgi/jvcr13pz.cgi?E+PZ+3+AOA0001+ERJ8GEY0R00V+7+WW; Image: //media.digikey.com/Renders/Panasonic%20Renders/ERJ-1206%20Pkg.jpg; Digi-Key Part Number: P0.0ECT-ND; Quantity Available: 1074190; Packaging: Cut Tape (CT); Series: ERJ; Part Status: Active; Value: 0.0; Tolerance: Jumper; Composition: Thick Film; Features: Automotive AEC-Q200; Temperature Coefficient: -; Operating Temperature: -55°C ~ 155°C; Package / Case: 1206 (3216 Metric); Supplier Device Package: 1206; Size / Dimension: 0.126" L x 0.063" W (3.20mm x 1.60mm); Height - Seated (Max): 0.028" (0.70mm); Number of Terminations: 2; Failure Rate: -; DNP: DNP
R?#2 R?#9 R?#11 = ERJ-P06J102V: RES SMD 1K OHM 5% 1/2W 0805; Manufacturer: Panasonic Electronic Components; Factory Stock: 0; Unit Price (USD): 0.01839; @ qty: 1500; Minimum Quantity: 1; Power (Watts): 0.5W, 1/2W; Temperature Coefficient: ±200ppm/°C; Part Number: ERJ-P06J102V; Datasheets: https://industrial.panasonic.com/cdbs/www-data/pdf/RDA0000/AOA0000C243.pdf; Image: //media.digikey.com/Renders/Panasonic%20Renders/ERJ-0805%20Pkg.jpg; Digi-Key Part Number: P1.0KADCT-ND; Quantity Available: 124757; Packaging: Cut Tape (CT); Series: ERJ; Part Status: Active; Value: 1k; Tolerance: ±5%; Composition: Thick Film; Features: Automotive AEC-Q200, Pulse Withstanding; Operating Temperature: -55°C ~ 155°C; Package / Case: 0805 (2012 Metric); Supplier Device Package: 0805; Size / Dimension: 0.079" L x 0.049" W (2.00mm x 1.25mm); Height - Seated (Max): 0.028" (0.70mm); Number of Terminations: 2; Failure Rate: -
R?#3 R?#10 = ERJ-P6WF1200V: RES SMD 120 OHM 1% 1/2W 0805; Manufacturer: Panasonic Electronic Components; Factory Stock: 0; Unit Price (USD): 0.10507; @ qty: 1500; Minimum Quantity: 1; Power (Watts): 0.5W, 1/2W; Temperature Coefficient: ±200ppm/°C; Part Number: ERJ-P6WF1200V; Datasheets: https://industrial.panasonic.com/cdbs/www-data/pdf/RDA0000/AOA0000C243.pdf; Image: //media.digikey.com/Renders/Panasonic%20Renders/ERJ-0805%20Pkg.jpg; Digi-Key Part Number: P16874CT-ND; Quantity Available: 9381; Packaging: Cut Tape (CT); Series: ERJ; Part Status: Active; Value: 120; Tolerance: ±1%; Composition: Thick Film; Features: Automotive AEC-Q200, Pulse Withstanding; Operating Temperature: -55°C ~ 155°C; Package / Case: 0805 (2012 Metric); Supplier Device Package: 0805; Size / Dimension: 0.079" L x 0.049" W (2.00mm x 1.25mm); Height - Seated (Max): 0.030" (0.75mm); Number of Terminations: 2; Failure Rate: -
S? = CL-SB-22B-01T: SWITCH SLIDE DPDT 200MA 12V; Manufacturer: Nidec Copal; Actuator Material: Nylon,Polyamide; Contact Style: Non-Shorting; Electrical Life: 10000Cycles; Switch Travel: 2mm; Switch Function: On-On; Actuator Type: Standard; Operating Force: 153gf; Supplier 1: Digi-Key; Stock 1: 3664; Pricing 1: 1=1.02, 10=0.979, 25=0.9592, 50=0.857, 100=0.8162, 250=0.79584 (USD); Mount: Surface Mount; Contact Material: Copper; Contact Plating: Silver; Min Operating Temperature: -40°C; Max Operating Temperature: 85°C; Packaging: Tape and Reel; Current Rating: 200mA; Voltage Rating (DC): 12V; Throw Configuration: DPDT; Termination: Gull Wing; Actuator Length: 2mm; Lead Free: Lead Free; ComponentLink1URL: https://www.nidec-copal-electronics.com/e/catalog/switch/cl-sb.pdf?src-supplier=Digi-Key; ComponentLink1Description: https://www.nidec-copal-electronics.com/e/catalog/switch/cl-sb.pdf?src-supplier=Digi-Key; Supplier Part Number 1: 563-1342-6-ND

## Sheet motor_controller_interface.SchDoc: RMS & Precharge Interface
size A4; Engineer: Shelby Riggleman; Organization: Badgerloop Electrical; Address1: 133 Engineering Research Building; Address2: 1500 Engineering Drive; Address3: Madison, Wi 53706; Revision: A
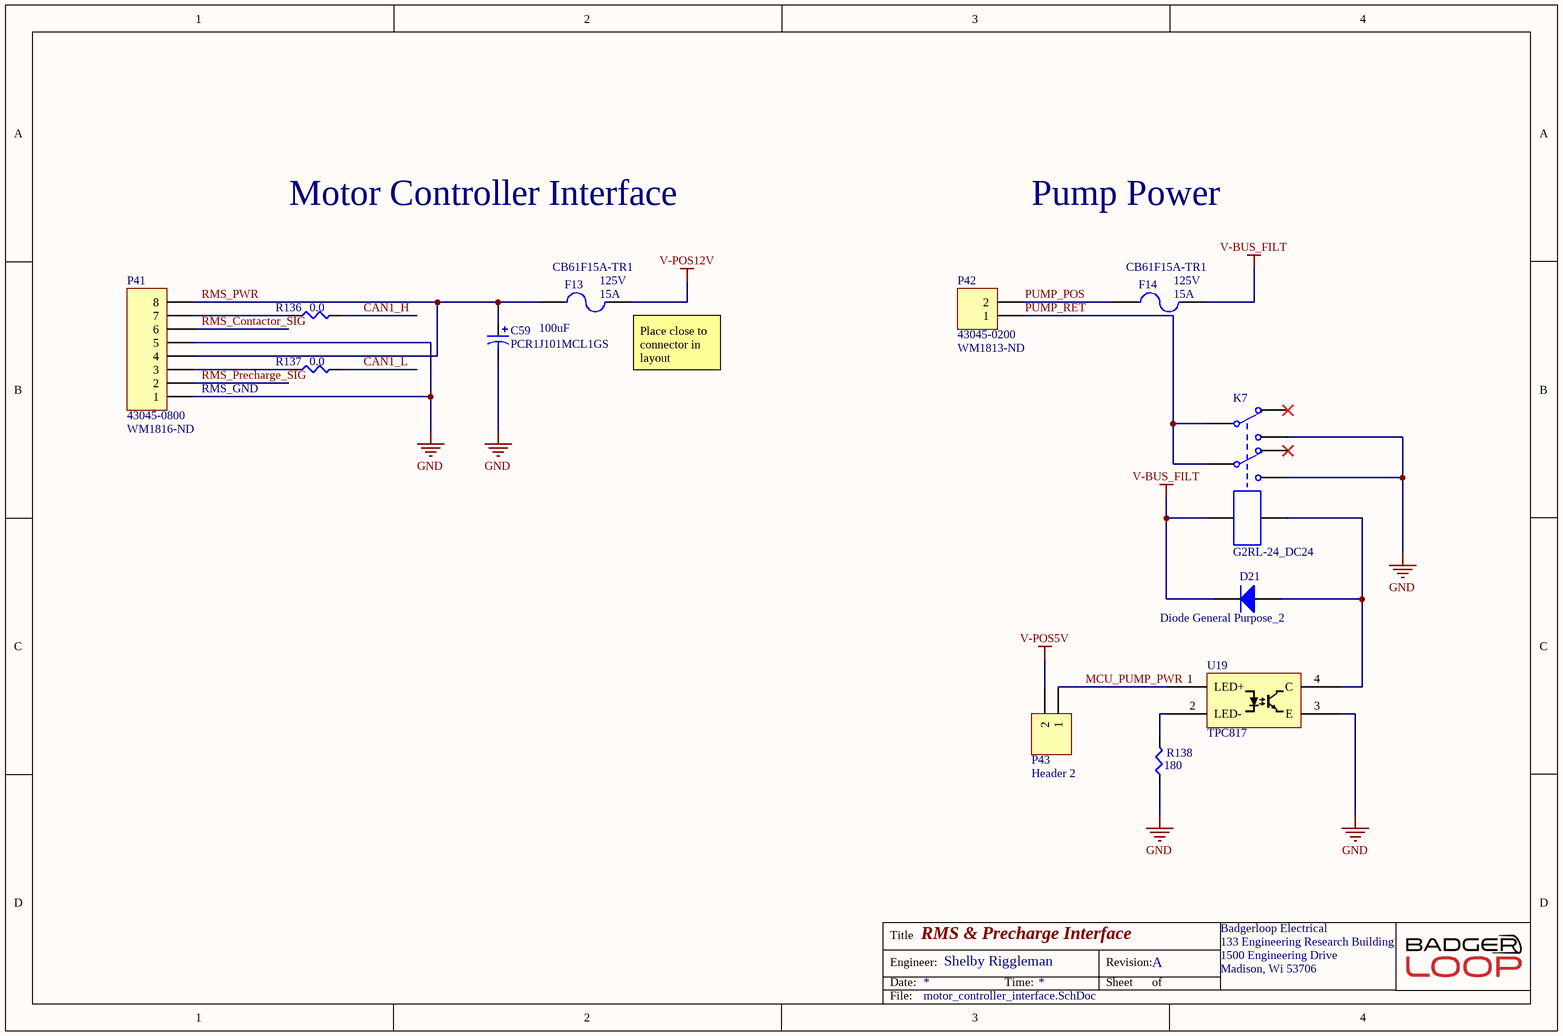
[diagram p10: motor_controller_interface.SchDoc]

### Parts
C59  PCR1J101MCL1GS  Capacitance: 100uF  [CAPAE110103X126M]
D21  Diode General Purpose_2  [SODFL250X110-2N]
F13  CB61F15A-TR1  Current Rating: 15A  Voltage Rating: 125V  [RESC6132X26N]
F14  CB61F15A-TR1  Current Rating: 15A  Voltage Rating: 125V  [RESC6132X26N]
K7  G2RL-24_DC24  [G2RL]
P41  43045-0800  Supplier Part Number 1: WM1816-ND  [430450800]
P42  43045-0200  Supplier Part Number 1: WM1813-ND  [430450200]
P43  Header 2  [Pin Header 1x2 TH Pitch 2.54mm]
R136  0.0  [SMD-1206-RES]
R137  0.0  [SMD-1206-RES]
R138  180  [SMD-0805-RES]
U19  TPC817  [SOT200P1005X328-5N]

### Nets
GND: C59.2 K7.4 K7.7 P41.1 P41.5 R138.1 U19.3(E)
V-BUS_FILT: D21.2(K) F14.2 K7.1  [project net MSTR_SW +]
V-POS5V: P43.2
V-POS12V: F13.2
CAN1_H: R136.2
CAN1_L: R137.2
MCU_PUMP_PWR: P43.1 U19.1(LED+)
PUMP_POS: F14.1 P42.2
PUMP_RET: K7.3 K7.6 P42.1
RMS_Contactor_SIG: P41.6
RMS_Precharge_SIG: P41.2
RMS_PWR: C59.1 F13.1 P41.4 P41.8
NetD21_1: D21.1(A) K7.8 U19.4(C)
NetP41_3: P41.3 R137.1
NetP41_7: P41.7 R136.1
NetR138_2: R138.2 U19.2(LED-)

Not connected (* = marked no-connect by the designer): K7 2* 5*

### Notes on the sheet
- Motor Controller Interface
- Pump Power
- (near F13) Place close to connector in layout
- (near P41) RMS_GND
- Title
- Engineer:
- Date:
- Time:
- Revision:
- Sheet
- of
- File:

### Library data of the parts
C59 = PCR1J101MCL1GS: as C?#1 on sheet bms_interface; Supplier 1: Digi-Key; Manufacturer Part Number: PCR1J101MCL1GS; Stock 1: 11476; Pricing 1: 1=3.63000, 10=2.92800, 100=2.28380 (USD); RoHS: Yes; Mount: Surface Mount,PCB; Case/Package: Radial; Weight: 0.045856oz; Min Operating Temperature: -55°C; Max Operating Temperature: 125°C; Tolerance: 20%; Voltage Rating (DC): 63V; Package Quantity: 1; Packaging: Tape and Reel; Voltage Rating: 63V; Termination: SMD/SMT; Voltage: 63V; Diameter: 10mm; Length: 12.7mm; Height: 12.7mm; Height - Seated (Max): 0.504inch; Depth: 10.3mm; Lead Pitch: 4.6mm; Lead Free: Lead Free; ComponentLink1URL: https://datasheet.ciiva.com/29551/e-ch-ta-29551389.pdf?src-supplier=Digi-Key; ComponentLink1Description: https://datasheet.ciiva.com/29551/e-ch-ta-29551389.pdf?src-supplier=Digi-Key; ComponentLink2URL: https://datasheet.ciiva.com/29551/e-ch-ta-29551390.pdf?src-supplier=Digi-Key; ComponentLink2Description: https://datasheet.ciiva.com/29551/e-ch-ta-29551390.pdf?src-supplier=Digi-Key; ComponentLink3URL: https://datasheet.ciiva.com/29551/e-ch-ta-29551391.pdf?src-supplier=Digi-Key; ComponentLink3Description: https://datasheet.ciiva.com/29551/e-ch-ta-29551391.pdf?src-supplier=Digi-Key; Supplier Part Number 1: 493-13783-1-ND
D21 = Diode General Purpose_2: DIODE GEN PURP 20V 350MA SOD323; Manufacturer: Diodes Incorporated; Manufacturer P/N: SD103CWS-7-F; Digikey P/N: SD103CWS-FDIDKR-ND; Package / Case: SOD323; Do Not Populate: *; ComponentLink1Description: Digikey; ComponentLink1URL: https://www.digikey.com/product-detail/en/diodes-incorporated/SD103CWS-7-F/SD103CWS-FDIDKR-ND/1836772; ComponentLink2Description: Datasheet; ComponentLink2URL: https://www.diodes.com/assets/Datasheets/ds30101.pdf; ComponentLink3Description: Dimensions; ComponentLink3URL: https://www.diodes.com/assets/Package-Files/SOD323.pdf
F13 F14 = CB61F15A-TR1: Manufacturer: Eaton; DC Cold Resistance: 4mR; Fuse Type: Board Mount (Cartridge Style Excluded); Approvals: cULus,PSE; Supplier 1: Digi-Key; Manufacturer Part Number: CB61F15A-TR1; Stock 1: 11809; Pricing 1: 1=1.15000, 5=1.11800, 10=1.04600, 50=0.86600, 100=0.72160, 250=0.70356, 500=0.59532 (USD); RoHS: Yes; Mount: Surface Mount; Case/Package: SMD/SMT; Packaging: Tape and Reel; Voltage Rating (AC): 125V; Voltage Rating (DC): 125V; Length: 0.24inch; Height: 0.101inch; Width: 0.101inch; Depth: 2.57mm; Lead Free: Lead Free; ComponentLink1URL: http://components.arrow.com/part/dataview/0323_05918082?src-supplier=Arrow+Europe; ComponentLink1Description: http://components.arrow.com/part/dataview/0323_05918082?src-supplier=Arrow+Europe; ComponentLink2URL: http://www.cooperindustries.com/content/dam/public/bussmann/Electronics/Resources/product-datasheets/bus-elx-ds-4377-cb61f.pdf?src-supplier=Avnet+Asia; ComponentLink2Description: http://www.cooperindustries.com/content/dam/public/bussmann/Electronics/Resources/product-datasheets/bus-elx-ds-4377-cb61f.pdf?src-supplier=Avnet+Asia; ComponentLink3URL: http://www.cooperindustries.com/content/dam/public/bussmann/Electronics/Resources/product-datasheets/bus-elx-ds-4377-cb61f.pdf?src-supplier=Avnet; ComponentLink3Description: http://www.cooperindustries.com/content/dam/public/bussmann/Electronics/Resources/product-datasheets/bus-elx-ds-4377-cb61f.pdf?src-supplier=Avnet; ComponentLink4URL: http://www.cooperindustries.com/content/dam/public/bussmann/Electronics/Resources/product-datasheets/bus-elx-ds-4377-cb61f.pdf?src-supplier=Digi-Key; ComponentLink4Description: http://www.cooperindustries.com/content/dam/public/bussmann/Electronics/Resources/product-datasheets/bus-elx-ds-4377-cb61f.pdf?src-supplier=Digi-Key; Supplier Part Number 1: 283-4104-1-ND
K7 = G2RL-24_DC24: RELAY GEN PURPOSE DPDT 8A 24V; Manufacturer: Omron; Manufacturer Part Number: G2RL-24-DC24; Voltage Rating (AC): 440V; Voltage Rating (DC): 300V; Power Consumption: 400mW; Coil Resistance: 1.44kR; Coil Current: 16.7mA; Operate Time: 15ms; Coil Type: Non-Latching; Relay Type: General Purpose; Release Time: 5ms; Supplier 1: Digi-Key; Stock 1: 13387; Pricing 1: 1=4.32, 10=4.053, 25=3.6028, 50=3.4226, 100=3.2425, 250=2.88224, 500=2.7021 (USD); Mount: Through Hole; Case/Package: DIP; Number of Pins: 8; Weight: 12g; Contact Material: Silver,Cadmium; Min Operating Temperature: -40°C; Max Operating Temperature: 85°C; Max Current Rating: 8A; Packaging: Bulk; Max Voltage Rating (AC): 440V; Max Voltage Rating (DC): 300V; Package Quantity: 20; Throw Configuration: DPDT; Termination: PC Pin; Contact Current Rating: 8A; Coil Voltage (DC): 24V; Coil Power: 400mW; Power Rating: 400mW; Length: 29mm; Height: 15.7mm; Width: 12.7mm; Depth: 12.7mm; Radiation Hardening: No; Lead Free: Lead Free; ComponentLink1URL: http://www.alliedelec.com/images/products/datasheets/bm/OMRON_ELECTRONICS_LLC/70175264.pdf?src-supplier=Allied+Electronics; ComponentLink1Description: http://www.alliedelec.com/images/products/datasheets/bm/OMRON_ELECTRONICS_LLC/70175264.pdf?src-supplier=Allied+Electronics; ComponentLink2URL: http://www.mouser.com/ds/2/307/en-g2rl-472571.pdf?src-supplier=Mouser; ComponentLink2Description: http://www.mouser.com/ds/2/307/en-g2rl-472571.pdf?src-supplier=Mouser
P41 = 43045-0800: CONN HEADER R/A 8POS 3MM; Manufacturer: Molex; Number of Contacts: 8; Contact Resistance: 10mR; Max Voltage Rating (DC): 250.25kV; Current Rating: 5A; Voltage Rating (AC): 250V; Voltage Rating: 600V; Gender: Male; Insulation Resistance: 1GR; Approvals: UL,CSA,TUV; Glow Wire Compliant: Compliant; Supplier 1: Digi-Key; Manufacturer Part Number: 43045-0800; Stock 1: 2632; Pricing 1: 1=1.91000, 10=1.73100, 100=1.48390, 500=1.23656, 1000=1.05990, 5000=0.93978, 10000=0.91858 (USD); RoHS: Yes; Mount: Through Hole; Case/Package: SMC; Contact Plating: Tin; Contact Material: Brass,Tin; Color: Black; Housing Color: Black; Housing Material: Thermoplastic; Material: Polyester; Min Operating Temperature: -40°C; Max Operating Temperature: 105°C; Number of Rows: 2; Termination: Solder; Packaging: Tray; Number of Positions: 8; Orientation: Right Angle; Number of Poles: 8; Package Quantity: 1440; Max Current Rating: 5A; Number of Circuits: 8; Working Voltage: 250V; Voltage Rating (DC): 250V; Diameter: 3mm; Length: 16.15mm; Height: 8.77mm; Pitch: 3mm; Row Spacing: 3mm; Depth: 12.2mm; Radiation Hardening: No; Flammability Rating: UL94 V-0; REACH SVHC: Unknown; Halogen Free: Low Halogen; Lead Free: Lead Free; ComponentLink1URL: https://datasheet.ciiva.com/5158/0430450800-pcb-headers-142625-5158817.pdf?src-supplier=Mouser; ComponentLink1Description: https://datasheet.ciiva.com/5158/0430450800-pcb-headers-142625-5158817.pdf?src-supplier=Mouser; ComponentLink2URL: https://datasheet.ciiva.com/7683/27645-7683683.pdf?src-supplier=Element14; ComponentLink2Description: https://datasheet.ciiva.com/7683/27645-7683683.pdf?src-supplier=Element14; ComponentLink3URL: https://datasheet.ciiva.com/19462/883536-19462164.pdf?src-supplier=Jameco; ComponentLink3Description: https://datasheet.ciiva.com/19462/883536-19462164.pdf?src-supplier=Jameco; ComponentLink4URL: https://datasheet.ciiva.com/11751/0900766b80027348-11751142.pdf?src-supplier=RSComponents; ComponentLink4Description: https://datasheet.ciiva.com/11751/0900766b80027348-11751142.pdf?src-supplier=RSComponents; ComponentLink5URL: https://datasheet.ciiva.com/30198/267770430450800-pcb-headers-30198875.pdf?src-supplier=Onlinecomponents.com; ComponentLink5Description: https://datasheet.ciiva.com/30198/267770430450800-pcb-headers-30198875.pdf?src-supplier=Onlinecomponents.com; ComponentLink6URL: https://datasheet.ciiva.com/1443/1850016-1443537.pdf?src-supplier=Element14; ComponentLink6Description: https://datasheet.ciiva.com/1443/1850016-1443537.pdf?src-supplier=Element14; ComponentLink7URL: https://datasheet.ciiva.com/14155/04402310-14155206.pdf?src-supplier=Distrelec; ComponentLink7Description: https://datasheet.ciiva.com/14155/04402310-14155206.pdf?src-supplier=Distrelec; ComponentLink8URL: https://datasheet.ciiva.com/16657/0430450800-pcb-headers-16657964.pdf?src-supplier=Avnet+Europe; ComponentLink8Description: https://datasheet.ciiva.com/16657/0430450800-pcb-headers-16657964.pdf?src-supplier=Avnet+Europe; ComponentLink9URL: https://datasheet.ciiva.com/10087/0430450800-pcb-headers-10087853.pdf?src-supplier=Avnet; ComponentLink9Description: https://datasheet.ciiva.com/10087/0430450800-pcb-headers-10087853.pdf?src-supplier=Avnet
P42 = 43045-0200: as P?#1 on sheet bms_interface; Supplier 1: Digi-Key; Manufacturer Part Number: 43045-0200; Stock 1: 6320; Pricing 1: 1=0.97000, 10=0.84900, 100=0.73280, 500=0.59958, 1000=0.53296, 5000=0.46634, 10000=0.44302 (USD); RoHS: Yes; Mount: Through Hole; Case/Package: SMC; Contact Plating: Tin; Color: Black; Contact Material: Brass,Tin; Housing Color: Black; Housing Material: Thermoplastic; Material: Thermoplastic; Min Operating Temperature: -40°C; Max Operating Temperature: 105°C; Termination: Through Hole; Number of Rows: 2; Orientation: Right Angle; Packaging: Tray; Number of Positions: 2; Package Quantity: 3168; Number of Circuits: 2; Contact Gender: Male; Diameter: 3mm; Row Spacing: 3mm; Radiation Hardening: No; Flammability Rating: UL94 V-0; REACH SVHC: Unknown; Lead Free: Lead Free; Halogen Free: Low Halogen; ComponentLink1URL: https://datasheet.ciiva.com/14155/04402310-14155203.pdf?src-supplier=Distrelec; ComponentLink1Description: https://datasheet.ciiva.com/14155/04402310-14155203.pdf?src-supplier=Distrelec; ComponentLink2URL: https://datasheet.ciiva.com/19454/883270-19454006.pdf?src-supplier=Jameco; ComponentLink2Description: https://datasheet.ciiva.com/19454/883270-19454006.pdf?src-supplier=Jameco; ComponentLink3URL: https://datasheet.ciiva.com/5150/0430450200-pcb-headers-145770-5150407.pdf?src-supplier=Mouser; ComponentLink3Description: https://datasheet.ciiva.com/5150/0430450200-pcb-headers-145770-5150407.pdf?src-supplier=Mouser; ComponentLink4URL: https://datasheet.ciiva.com/11747/0900766b80027348-11747001.pdf?src-supplier=RSComponents; ComponentLink4Description: https://datasheet.ciiva.com/11747/0900766b80027348-11747001.pdf?src-supplier=RSComponents; ComponentLink5URL: https://datasheet.ciiva.com/16656/0430450200-pcb-headers-16656330.pdf?src-supplier=Avnet+Europe; ComponentLink5Description: https://datasheet.ciiva.com/16656/0430450200-pcb-headers-16656330.pdf?src-supplier=Avnet+Europe; ComponentLink6URL: https://datasheet.ciiva.com/10090/0430450200-pcb-headers-10090299.pdf?src-supplier=Avnet; ComponentLink6Description: https://datasheet.ciiva.com/10090/0430450200-pcb-headers-10090299.pdf?src-supplier=Avnet; ComponentLink7URL: https://datasheet.ciiva.com/36854/124280430450200-pcb-headers-36854331.pdf?src-supplier=Onlinecomponents.com; ComponentLink7Description: https://datasheet.ciiva.com/36854/124280430450200-pcb-headers-36854331.pdf?src-supplier=Onlinecomponents.com; ComponentLink8URL: https://datasheet.ciiva.com/1443/1859921-1443437.pdf?src-supplier=Element14; ComponentLink8Description: https://datasheet.ciiva.com/1443/1859921-1443437.pdf?src-supplier=Element14
P43 = Header 2: Header, 2-Pin; LatestRevisionDate: 17-Jul-2002; LatestRevisionNote: Re-released for DXP Platform.; Publisher: Altium Limited
R136 R137 = ERJ-8GEY0R00V: as R178 on sheet retros; Part Number: ERJ-8GEY0R00V; Datasheets: http://industrial.panasonic.com/www-cgi/jvcr13pz.cgi?E+PZ+3+AOA0001+ERJ8GEY0R00V+7+WW; Image: //media.digikey.com/Renders/Panasonic%20Renders/ERJ-1206%20Pkg.jpg; Digi-Key Part Number: P0.0ECT-ND; Quantity Available: 1074190; Packaging: Cut Tape (CT); Series: ERJ; Part Status: Active; Value: 0.0; Tolerance: Jumper; Composition: Thick Film; Features: Automotive AEC-Q200; Temperature Coefficient: -; Operating Temperature: -55°C ~ 155°C; Package / Case: 1206 (3216 Metric); Supplier Device Package: 1206; Size / Dimension: 0.126" L x 0.063" W (3.20mm x 1.60mm); Height - Seated (Max): 0.028" (0.70mm); Number of Terminations: 2; Failure Rate: -
R138 = ERJ-6ENF1800V: as R162 on sheet retros; Part Number: ERJ-6ENF1800V; Datasheets: http://industrial.panasonic.com/www-cgi/jvcr13pz.cgi?E+PZ+3+AOA0002+ERJ6ENF1800V+7+WW; Image: //media.digikey.com/Renders/Panasonic%20Renders/ERJ-0805%20Pkg.jpg; Digi-Key Part Number: P180CCT-ND; Quantity Available: 33231; Packaging: Cut Tape (CT); Series: ERJ; Part Status: Active; Value: 180; Tolerance: ±1%; Composition: Thick Film; Features: Automotive AEC-Q200; Operating Temperature: -55°C ~ 155°C; Package / Case: 0805 (2012 Metric); Supplier Device Package: 0805; Size / Dimension: 0.079" L x 0.049" W (2.00mm x 1.25mm); Height - Seated (Max): 0.028" (0.70mm); Number of Terminations: 2; Failure Rate: -
U19 = TPC817: as U25 on sheet retros; Digikey Link: https://www.digikey.com/product-detail/en/taiwan-semiconductor-corporation/TPC817S1B-RAG/TPC817S1BRAGCT-ND/7359679; Digikey P/N: TPC817S1BRAGCT-ND